# EAGLE schematic powersypply_led (EAGLE 9.6.2)
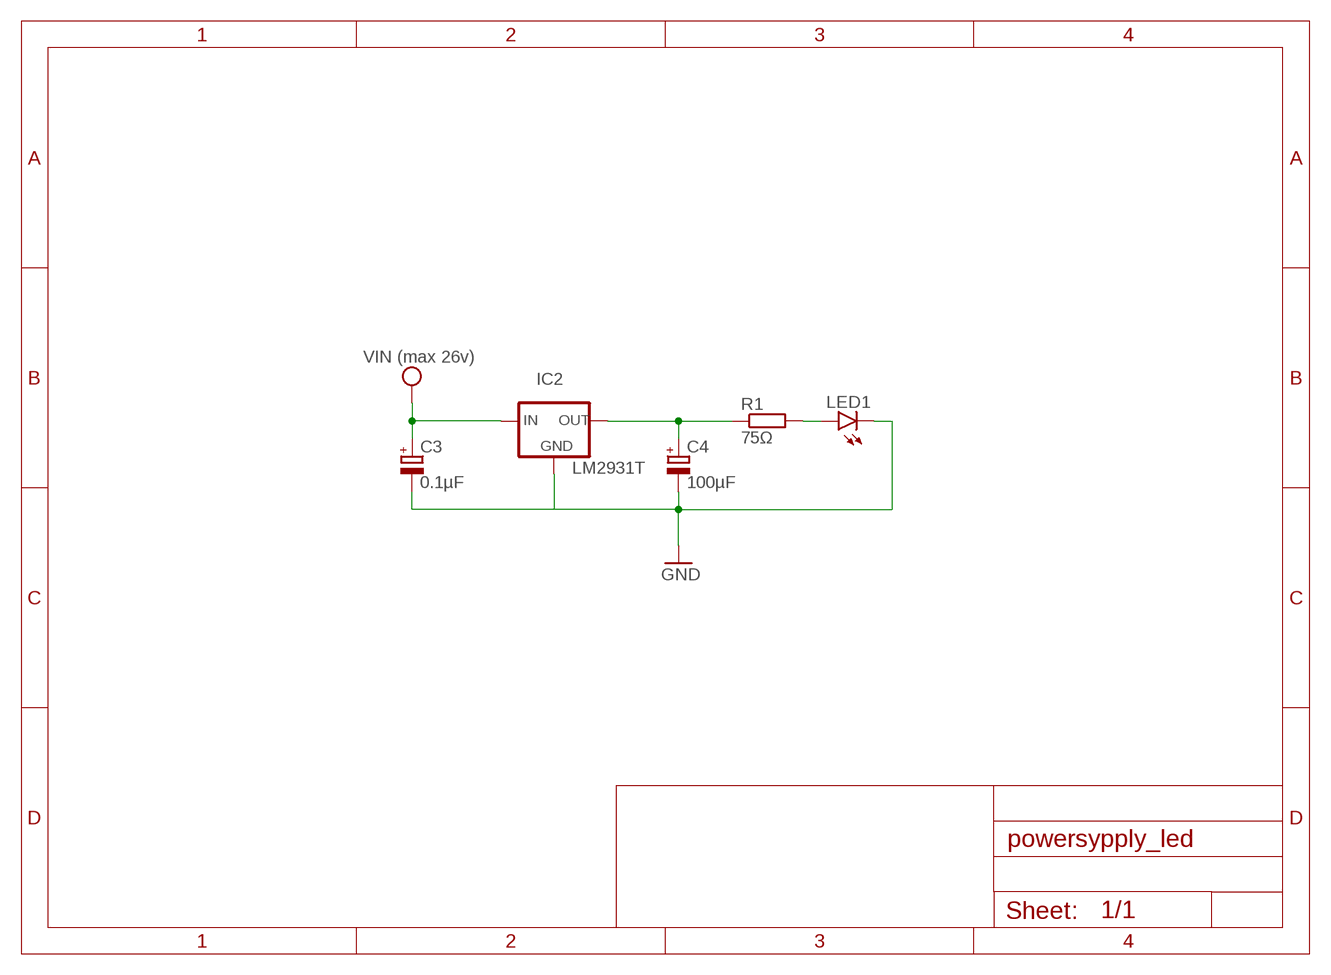
[diagram p0: schematic, sheet 1]

## Parts
C3  0.1µF  CPOL-EUE5-5  [E5-5]
C4  100µF  CPOL-EUE5-5  [E5-5]
IC2  LM2931T  [TO220S]
LED1  SFH482  [SFH482]
R1  75Ω  R-EU_0617/17  [0617/17]

## Nets
GND: C3.- C4.- IC2.2(GND) LED1.K(C)
N$1: LED1.A R1.2
N$4: C4.+ IC2.3(OUT) R1.1
VCC: C3.+ IC2.1(IN) ; supply symbol labelled VIN (max 26v)

## Library data of the parts
C3 C4 = rcl:CPOL-EU: POLARIZED CAPACITOR, European symbol; SPICEPREFIX: C
IC2 = v-reg-3:LM2931: National Semiconductor <http://www.national.com> Low Dropout Fixed Regulator Vin up to 26V, Reverse Batterie/Load Dump/Short Circuit/Overload Protection,
LED1 = led:SFH482: IR LED infrared emitting diode, Infineon
R1 = rcl:R-EU_: RESISTOR, European symbol; SPICEPREFIX: R